# EAGLE design bmsadapt18-16 (EAGLE 4.13)
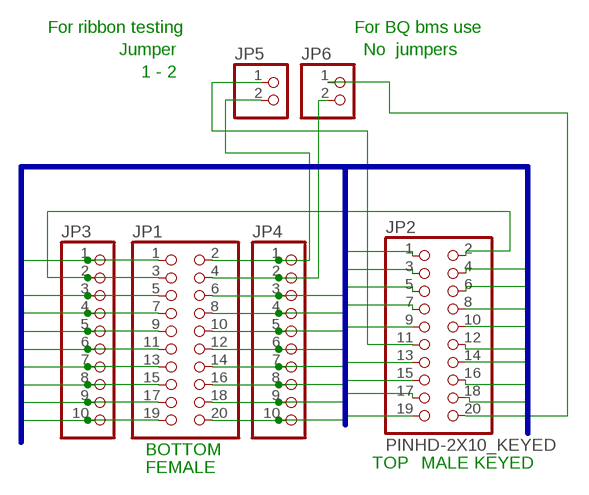
[diagram p0: schematic, sheet 1]

## Parts
JP1  PINHD-2X10  [2X10]
JP2  PINHD-2X10_KEYED  [2X10_KEYED]
JP3  PINHD-1X10  [1X10]
JP4  PINHD-1X10  [1X10]
JP5  PINHD-1X2  [1X02]
JP6  PINHD-1X2  [1X02]

## Nets
C0: JP1.4 JP4.2 JP6.2
C1: JP1.13 JP2.12 JP3.7
C2: JP1.5 JP2.3 JP3.3
C3: JP1.14 JP2.13 JP4.7
C4: JP1.6 JP2.4 JP4.3
C5: JP1.15 JP2.14 JP3.8
C6: JP1.7 JP2.5 JP3.4
C7: JP1.16 JP2.15 JP4.8
C8: JP1.8 JP2.6 JP4.4
C9: JP1.17 JP2.16 JP3.9
C10: JP1.9 JP2.7 JP3.5
C11: JP1.18 JP2.17 JP4.9
C12: JP1.10 JP2.8 JP4.5
C13: JP1.19 JP2.18 JP3.10
C14: JP1.11 JP2.9 JP3.6
C15: JP1.20 JP2.19 JP4.10
C16: JP1.12 JP2.10 JP4.6
C17: JP2.20 JP6.1
C18: JP2.11 JP5.1
GND: JP1.3 JP2.2 JP3.2
PGND-SRN: JP1.1 JP2.1 JP3.1
SRP: JP1.2 JP4.1 JP5.2

## Buses
HDR$:PGND-SRN,SRP,VSS,C[0..16]

## Notes on the sheet
- For ribbon testing | For BQ bms use
- Jumper | No  jumpers
- 1 - 2
- BOTTOM
- FEMALE | TOP | MALE KEYED

## Library data of the parts
JP1 = pinhead:PINHD-2X10: PIN HEADER
JP2 = pinhead:PINHD-2X10_KEYED
JP3 JP4 = pinhead:PINHD-1X10: PIN HEADER
JP5 JP6 = pinhead:PINHD-1X2: PIN HEADER

## Board
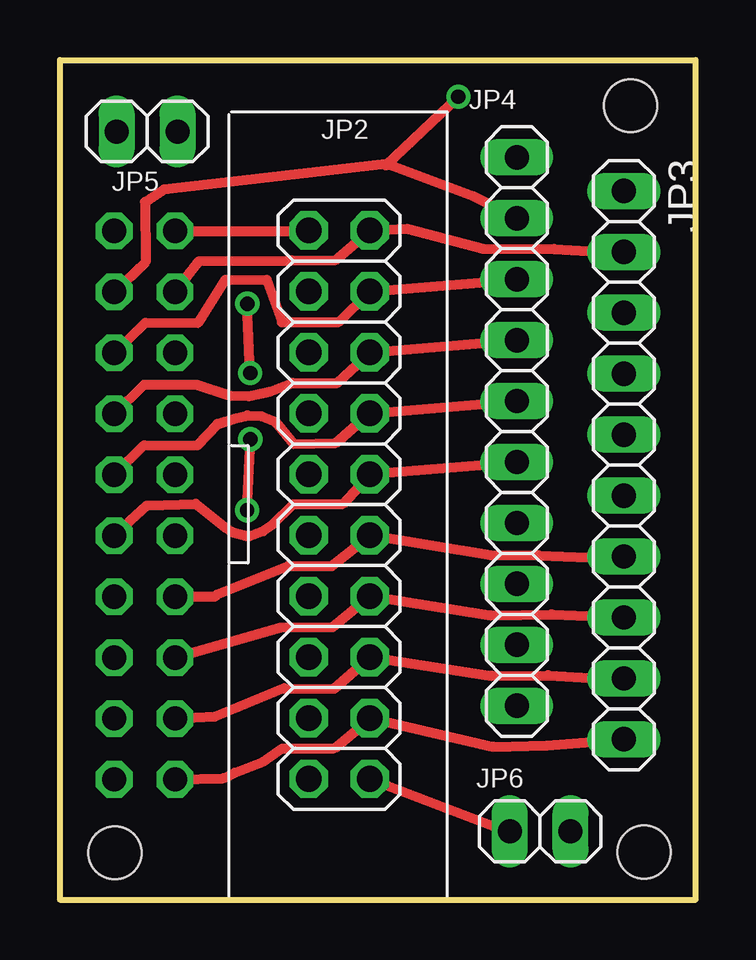
[diagram p1: board, top side]
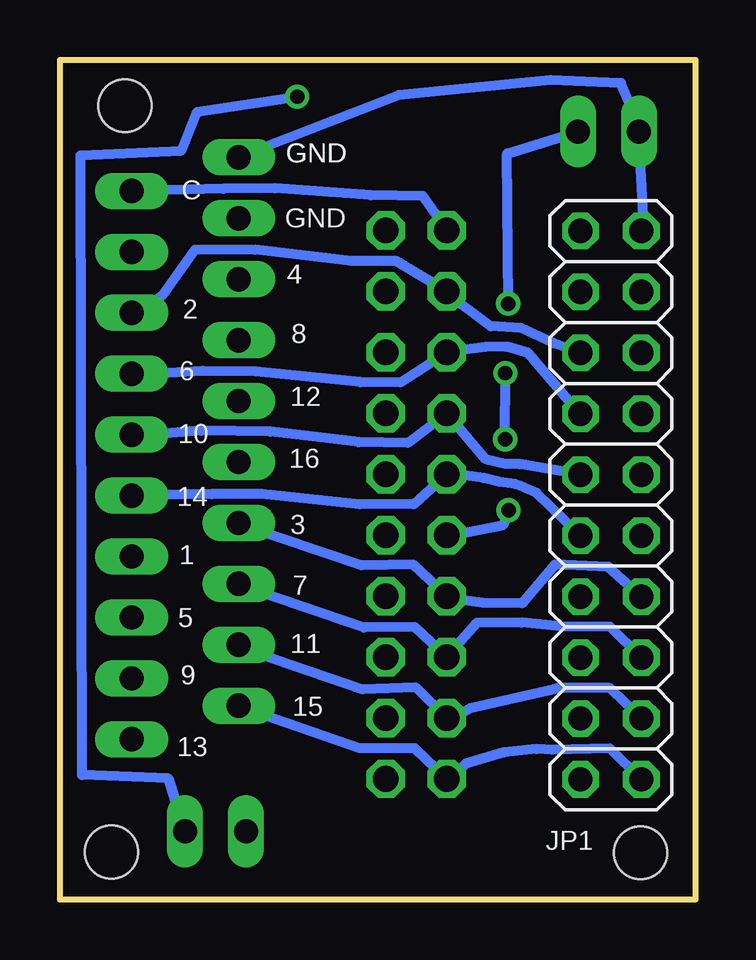
[diagram p2: board, bottom side, seen from below]

Size 26.5 x 35 mm. Coordinates in mm from the lower left corner, seen from the top.
Outline: 0,0 26.5,0 26.5,35 0,35 0,0
Copper layers (1*16): Top 0.035mm / dielectric 1.5mm / Bottom 0.035mm
Design rules "default": minimum track width 8mil, minimum drill 0.6mm, track to track 8mil, track to pad 8mil, pad to pad 8mil, via to via 8mil, smd to smd 0mil, copper to edge 8mil, drill to drill 8mil, minimum pad ring 10mil, minimum via ring 8mil, stop-mask expansion 4mil, vias tented up to drill 0mil, thermal gap 10mil
Holes 2.2 mm at 24.35,1.98 23.79,33.09 2.29,1.95

### Footprints (pad centres in the part's own frame; a part is rotated, then mirrored left to right if it is on the bottom)
2X10 = drill 1.016 octagon: 1 -11.43,-1.27; 2 -11.43,1.27; 3 -8.89,-1.27; 4 -8.89,1.27; 5 -6.35,-1.27; 6 -6.35,1.27; 7 -3.81,-1.27; 8 -3.81,1.27; 9 -1.27,-1.27; 10 -1.27,1.27; 11 1.27,-1.27; 12 1.27,1.27; 13 3.81,-1.27; 14 3.81,1.27; 15 6.35,-1.27; 16 6.35,1.27; 17 8.89,-1.27; 18 8.89,1.27; 19 11.43,-1.27; 20 11.43,1.27
2X10_KEYED = drill 1.067 octagon: 1 -11.46,-1.27; 2 -11.46,1.27; 3 -8.92,-1.27; 4 -8.92,1.27; 5 -6.38,-1.27; 6 -6.38,1.27; 7 -3.84,-1.27; 8 -3.84,1.27; 9 -1.3,-1.27; 10 -1.3,1.27; 11 1.24,-1.27; 12 1.24,1.27; 13 3.78,-1.27; 14 3.78,1.27; 15 6.32,-1.27; 16 6.32,1.27; 17 8.86,-1.27; 18 8.86,1.27; 19 11.4,-1.27; 20 11.4,1.27
1X10 = drill 1.016 long: 1 -11.43,0; 2 -8.89,0; 3 -6.35,0; 4 -3.81,0; 5 -1.27,0; 6 1.27,0; 7 3.81,0; 8 6.35,0; 9 8.89,0; 10 11.43,0
1X02 = drill 1 long: 1 -1.27,0; 2 1.27,0

### Placement (x,y rotation side)
JP1  3.53,16.44 270 bottom
JP2  11.64,16.43 270 top
JP3  23.51,18.11 270 top
JP4  19.05,19.51 270 top
JP5  3.63,32.02 180 top
JP6  20.02,2.84 0 top

### Tracks (layer width: path | path; a pad name or v marks a point on that pad's centre or on a via)
C0  (via drill 0.6)
  Top 0.406: JP4.2 17.24,29.32 13.73,30.64 | JP1.4 3.57,26.58 3.55,29.08 4.34,29.6 13.75,30.67 13.73,30.64 | 13.73,30.64 13.59,30.61 v16.61,33.47
  Bottom 0.406: JP6.2 21.97,5.05 25.58,5.19 25.64,31.03 21.43,31.22 20.78,32.84 v16.61,33.47
C1
  Top 0.406: JP1.13 6.48,12.64 6.55,12.71 9.51,13.9 11.33,13.9 12.88,15.13 JP2.12 17.95,14.36 19.95,14.35 23.6,14.2 JP3.7
C2
  Bottom 0.406: JP1.5 5.92,23.19 7.29,23.83 8.55,23.9 10.44,25.33 JP2.3 12.49,26.62 14.35,26.62 18.37,27.09 20.88,27.08 22.22,25.2 23.17,24.48 JP3.3
C3
  Bottom 0.406: JP1.14 3.63,13.87 5.87,13.96 7.23,12.35 8.87,12.37 10.4,12.58 JP2.13 11.77,13.96 13.91,13.93 19.09,15.68 JP4.7
C4
  Top 0.406: JP1.6 3.57,24.05 5.76,24.04 6.89,25.83 8.62,25.84 9.26,24.07 11.63,24.08 JP2.4 JP4.3
C5
  Top 0.406: JP3.8 23.49,11.76 20.5,11.89 17.96,11.85 JP2.14 12.91,12.63 11.37,11.36 9.19,11.34 4.83,10.09 JP1.15
C6
  Bottom 0.406: JP1.7 6.97,22.78 7.89,23.05 8.74,23.04 10.43,22.83 JP2.5 12.31,21.56 13.97,21.57 18.34,22.02 20.55,22.04 23.4,21.87 JP3.4
C7
  Bottom 0.406: JP1.16 3.56,11.37 5.62,11.39 7.25,11.55 9.11,11.54 10.42,10.06 JP2.15 11.69,11.36 13.83,11.34 19.08,13.14 JP4.8
C8
  Top 0.406: JP4.4 19.08,23.32 JP2.6 12.94,22.8 11.58,21.54 9.7,21.54 8.76,21.17 7.88,20.98 7.1,21.01 5.69,21.46 3.51,21.46 JP1.8
C9
  Top 0.406: JP1.17 6.46,7.63 9.35,8.82 9.34,8.79 11.44,8.8 12.94,10.12 JP2.16 17.99,9.33 20.36,9.35 23.52,9.16 JP3.9
C10
  Bottom 0.406: JP1.9 7.34,18.15 7.95,18.16 8.73,18.35 10.42,20.34 JP2.7 12,19.04 14.04,19.07 17.72,19.51 20.62,19.55 23.63,19.31 JP3.5
C11
  Bottom 0.406: JP1.18 3.57,8.82 5.77,8.82 6.08,8.72 9.39,7.97 10.29,7.5 JP2.17 11.66,8.84 13.88,8.77 19.06,10.54 JP4.9
C12
  Top 0.406: JP4.5 19.09,20.78 JP2.8 12.89,20.23 11.51,19.04 9.73,18.99 8.97,19.92 8.39,20.15 7.82,20.18 7.28,20.05 6.57,19.83 5.72,18.93 3.52,18.94 JP1.10
C13
  Top 0.406: JP1.19 6.82,5.06 7.29,5.29 8.47,5.74 9.27,6.3 11.44,6.31 12.94,7.55 JP2.18 18.07,6.37 20.31,6.42 23.56,6.67 JP3.10
C14
  Bottom 0.406: JP1.11 6.63,16.95 7.31,17.25 7.51,17.32 8.18,17.41 8.83,17.57 9.6,17.68 10.45,17.77 JP2.9 11.75,16.48 13.99,16.47 18.09,16.91 20.17,16.9 23.54,16.84 JP3.6
C15
  Bottom 0.406: JP1.20 3.57,6.3 5.97,6.25 6.63,6.28 7.99,6.13 9.59,5.66 10.36,4.95 JP2.19 11.7,6.31 13.99,6.31 19.09,8.08 JP4.10
C16
  Top 0.406: JP4.6 19.07,18.25 JP2.10 12.97,17.77 11.8,16.5 9.73,16.48 8.85,15.62 8.47,15.36 7.86,15.13 7.16,15.33 6.93,15.48 5.67,16.5 3.63,16.42 JP1.12
C17
  Top 0.406: JP6.1 18.81,2.78 JP2.20
C18  (via drill 0.6)
  Top 0.406: v7.93,21.95 v7.81,24.84 | v7.8,16.23 v7.94,19.19
  Bottom 0.406: JP5.1 7.86,31.1 v7.81,24.84 | v7.94,19.19 v7.93,21.95 | v7.8,16.23 8.02,15.62 10.35,15.16 JP2.11
GND
  Top 0.406: JP1.3 4.77,25.28 5.8,26.61 9.67,26.64 11.49,26.66 JP2.2 14.47,27.96 17.63,27.13 20.6,27.12 23.48,26.95 JP3.2
PGND-SRN
  Top 0.406: JP2.1 10.36,27.87 JP1.1
  Bottom 0.406: JP3.1 19.69,29.63 17.55,29.65 13.54,29.36 11.37,29.33 10.3,27.82 JP2.1
SRP
  Bottom 0.406: 19.13,30.88 JP4.1 12.37,33.54 6.05,34.16 3.11,34.04 2.36,32.31 JP5.2 2.14,27.72 JP1.2

### Text on the board
bPlace: GND | GND | C | GND | 4 | 2 | 8 | 6 | 12 | 10 | 16 | 14 | 3 | 1 | 7 | 5 | 11 | 9 | 15 | 13
tValues: 3.3V | DIGITAL | +5V | 3.2v | ANALOG | 3.2